# Altium project MIDDLE LAYER.PrjPCB
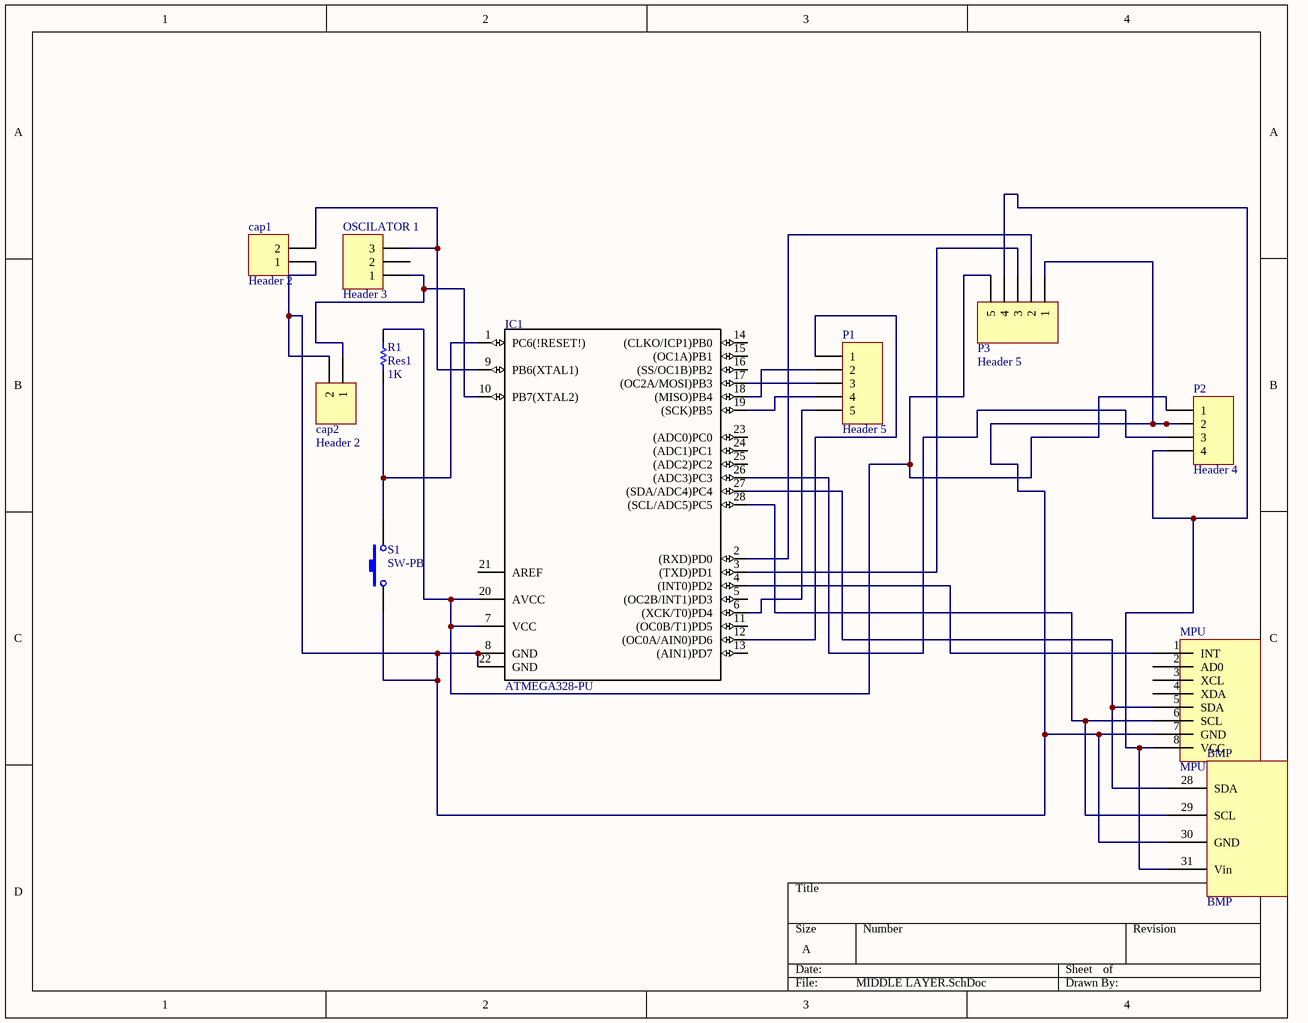
[diagram p0: MIDDLE LAYER.SchDoc]
1 sheet, 11 parts. Net scope: global (net labels, ports and power ports of the same name join across sheets).
Board file: final.PcbDoc

## Sheet MIDDLE LAYER.SchDoc
size A

### Parts
BMP  BMP  [BMP]
cap1  Header 2  [HDR1X2]
cap2  Header 2  [HDR1X2]
IC1  ATMEGA328-PU  [*DIL28]
MPU  MPU  [MPU]
OSCILATOR_1  Header 3  [HDR1X3]
P1  Header 5  [HDR1X5]
P2  Header 4  [HDR1X4]
P3  Header 5  [HDR1X5]
R1  Res1  value 1K  [AXIAL-0.3]
S1  SW-PB  [SPST-2]

### Nets
NetBMP_28: BMP.28(SDA) IC1.27((SDA/ADC4)PC4) MPU.5(SDA)
NetBMP_29: BMP.29(SCL) IC1.28((SCL/ADC5)PC5) MPU.6(SCL)
NetBMP_30: BMP.30(GND) cap1.1 cap2.2 IC1.8(GND) IC1.22(GND) MPU.7(GND) P2.2 P3.1 S1.1
NetBMP_31: BMP.31(Vin) MPU.8(VCC) P2.4 P3.4
Netcap1_2: cap1.2 IC1.9(PB6(XTAL1)) OSCILATOR_1.3
Netcap2_1: cap2.1 IC1.10(PB7(XTAL2)) OSCILATOR_1.1
NetIC1_1: IC1.1(PC6(!RESET!)) R1.1 S1.2
NetIC1_2: IC1.2((RXD)PD0) P3.2
NetIC1_3: IC1.3((TXD)PD1) P3.3
NetIC1_4: IC1.4((INT0)PD2) MPU.1(INT)
NetIC1_6: IC1.6((XCK/T0)PD4) P1.5
NetIC1_7: IC1.7(VCC) IC1.20(AVCC) P2.1 P3.5 R1.2
NetIC1_12: IC1.12((OC0A/AIN0)PD6) P1.1
NetIC1_17: IC1.17((OC2A/MOSI)PB3) P1.3
NetIC1_18: IC1.18((MISO)PB4) P1.2
NetIC1_19: IC1.19((SCK)PB5) P1.4
NetIC1_26: IC1.26((ADC3)PC3) P2.3

Not connected (* = marked no-connect by the designer): IC1 5((OC2B/INT1)PD3) 11((OC0B/T1)PD5) 13((AIN1)PD7) 14((CLKO/ICP1)PB0) 15((OC1A)PB1) 16((SS/OC1B)PB2) 21(AREF) 23((ADC0)PC0) 24((ADC1)PC1) 25((ADC2)PC2); MPU 2(AD0) 3(XCL) 4(XDA); OSCILATOR_1 2

### Library data of the parts
cap1 cap2 = Header 2: Header, 2-Pin; LatestRevisionDate: 17-Jul-2002; LatestRevisionNote: Re-released for DXP Platform.; Publisher: Altium Limited
IC1 = ATMEGA328-PU: ATmega Series 20 MHz 32 KB Flash 2 KB SRAM 8-Bit Microcontroller - DIP-28; MF: Microchip; Package: PDIP-28 Microchip; Price: None; MP: ATMEGA328-PU; SnapEDA_Link: https://www.snapeda.com/parts/ATMEGA328-PU/Microchip/view-part/?ref=snap; Availability: Unavailable; Value: *
OSCILATOR_1 = Header 3: Header, 3-Pin; LatestRevisionDate: 17-Jul-2002; LatestRevisionNote: Re-released for DXP Platform.; Publisher: Altium Limited
P1 P3 = Header 5: Header, 5-Pin; LatestRevisionDate: 17-Jul-2002; LatestRevisionNote: Re-released for DXP Platform.; Publisher: Altium Limited
P2 = Header 4: Header, 4-Pin; LatestRevisionDate: 17-Jul-2002; LatestRevisionNote: Re-released for DXP Platform.; Publisher: Altium Limited
R1 = Res1: Resistor; Published: 8-Jun-2000; LatestRevisionDate: 17-Jul-2002; LatestRevisionNote: Re-released for DXP Platform.; PackageReference: AXIAL-0.3; Publisher: Altium Limited; PackageDescription: Axial Device, Thru-Hole; 2 Leads; 0.3 in Pin Spacing
S1 = SW-PB: Switch; Published: 24-Mar-1999; LatestRevisionDate: 17-Jul-2002; LatestRevisionNote: Re-released for DXP Platform.; PackageReference: SPST-2; Publisher: Altium Limited; PackageDescription: Switch; 2 Leads